# Altium schematic sheet PSU_DRIVE.SchDoc
size A4
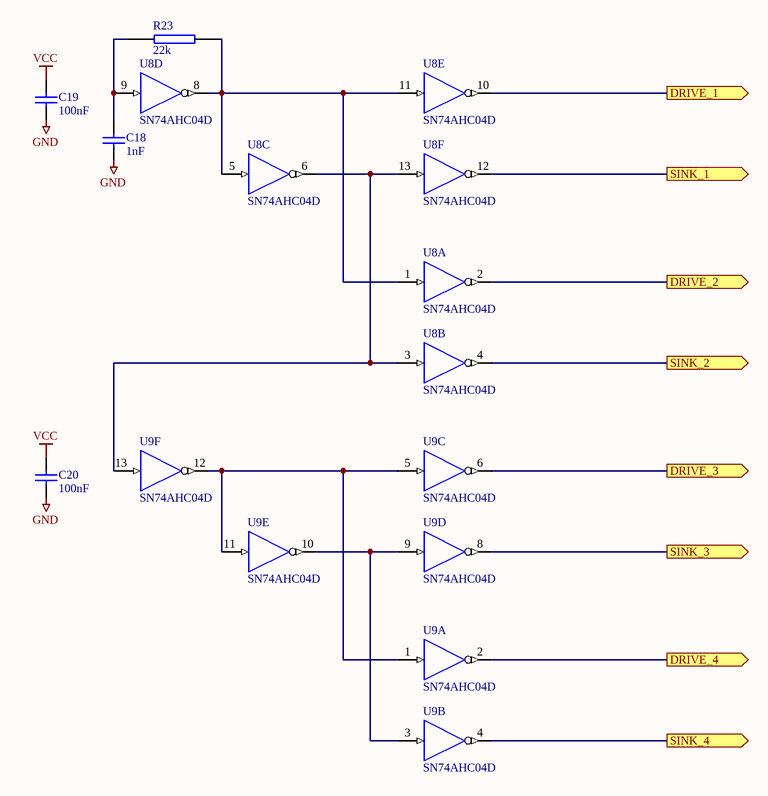
[diagram p0: PSU_DRIVE.SchDoc]

## Parts
C18  value 1nF  [CAP (3D) - 0603]  (hidden comment: Cap)
C19  100nF  [CAP (3D) - 0603]
C20  100nF  [CAP (3D) - 0603]
R23  22k  [RES (3D) - 0603]
U8  SN74AHC04D  [SOIC-14]  (parts A,B,C,D,E,F of 6)
U9  SN74AHC04D  [SOIC-14]  (parts A,B,C,D,E,F of 6)

## Ports
DRIVE_1 (out), DRIVE_2 (out), DRIVE_3 (out), DRIVE_4 (out), SINK_1 (out), SINK_2 (out), SINK_3 (out), SINK_4 (out)

## Nets
GND: C18.2 C19.1 C20.1 U8.7(GND) U9.7(GND)
VCC: C19.2 C20.2 U8.14(VCC) U9.14(VCC)
DRIVE_1: U8.10(Y) ; port DRIVE_1
DRIVE_2: U8.2(Y) ; port DRIVE_2
DRIVE_3: U9.6(Y) ; port DRIVE_3
DRIVE_4: U9.2(Y) ; port DRIVE_4
SINK_1: U8.12(Y) ; port SINK_1
SINK_2: U8.4(Y) ; port SINK_2
SINK_3: U9.8(Y) ; port SINK_3
SINK_4: U9.4(Y) ; port SINK_4
NetC18_1: C18.1 R23.2 U8.9(A)
NetR23_1: R23.1 U8.1(A) U8.5(A) U8.8(Y) U8.11(A)
NetU8_3: U8.3(A) U8.6(Y) U8.13(A) U9.13(A)
NetU9_1: U9.1(A) U9.5(A) U9.11(A) U9.12(Y)
NetU9_3: U9.3(A) U9.9(A) U9.10(Y)

## Library data of the parts
C18-C20 = Cap: Capacitor
  C18: Published: 8-Jun-2000; LatestRevisionDate: 17-Jul-2002; LatestRevisionNote: Re-released for DXP Platform.; PackageReference: RAD-0.3; Publisher: Altium Limited; PackageDescription: Radial Cap, Thru-Hole; 2 Leads; 0.3 in Pin Spacing
  C19 C20: Value: 100nF; Supplier 1: Mouser; Supplier 2: Digi-Key; Supplier Part Number 1: 603-C0603ZRY5V9BB104; Supplier Part Number 2: 311-1343-2-ND
R23 = RES SMD 0603 10k: RESISTOR SMD 0603 10k; value: 22k
U8 U9 = SN74AHC04D: Hex Inverter; Published: 8-Jun-2000; LatestRevisionDate: 13-Apr-2006; LatestRevisionNote: IPC-7351 Footprint Added.; DatasheetVersion: Jun-1998; PackageVersion: Jan-1998; PackageReference: D014; Publisher: Altium Limited; PackageDescription: 14-Pin Small Outline Integrated Circuit 1.27 mm Pitch; Code_IPC: SOIC127P600-14; ComponentLink1Description: Manufacturer Link; ComponentLink1URL: http://www.ti.com/; ComponentLink2Description: Datasheet; ComponentLink2URL: http://www-s.ti.com/sc/ds/sn74ahc04.pdf; ComponentLink3Description: Packaging Specification; ComponentLink3URL: http://focus.ti.com/lit/ml/mpds177/mpds177.pdf